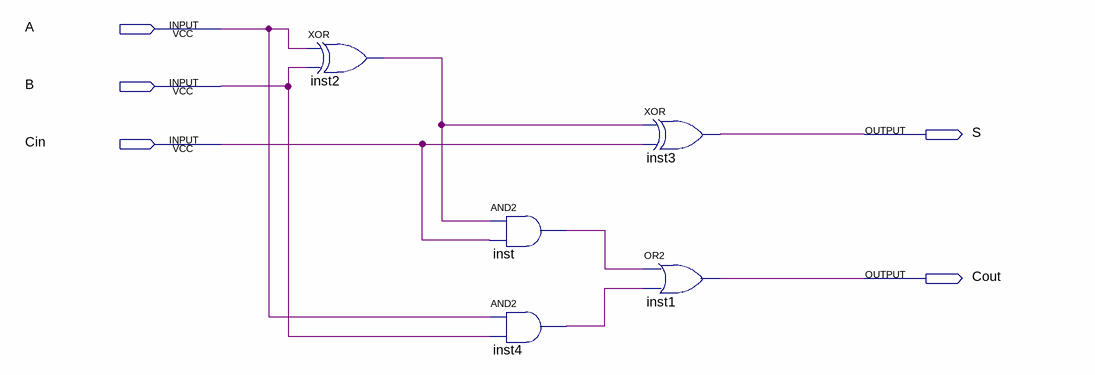
[diagram p0: schematic sheet]
// Quartus schematic FA.bdf as structural Verilog: 5 symbols, 5 pins
module FA (
  input  A,
  input  B,
  input  Cin,
  output S,
  output Cout
);

  wire inst2_out, inst4_out, inst_out;

  xor inst2 (inst2_out, A, B);
  and inst (inst_out, inst2_out, Cin);
  and inst4 (inst4_out, A, B);
  xor inst3 (S, inst2_out, Cin);
  or inst1 (Cout, inst_out, inst4_out);
endmodule
